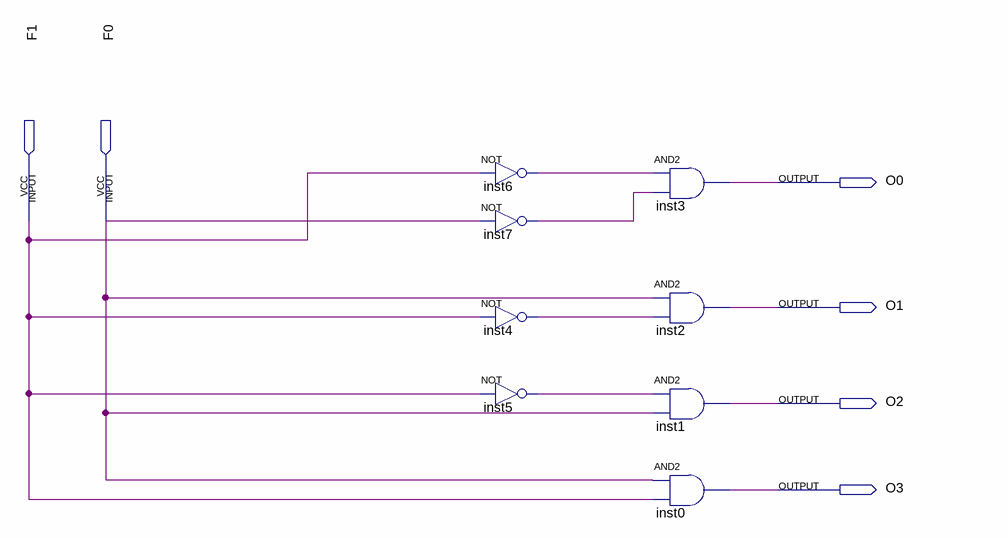
[diagram p0: schematic sheet]
// Quartus schematic DECODER_2x4.bdf as structural Verilog: 8 symbols, 6 pins
module DECODER_2x4 (
  input  F1,
  input  F0,
  output O0,
  output O1,
  output O2,
  output O3
);

  wire inst4_out, inst5_out, inst6_out, inst7_out;

  not inst6 (inst6_out, F1);
  not inst7 (inst7_out, F0);
  not inst4 (inst4_out, F1);
  not inst5 (inst5_out, F1);
  and inst3 (O0, inst6_out, inst7_out);
  and inst2 (O1, F0, inst4_out);
  and inst1 (O2, inst5_out, F0);
  and inst0 (O3, F0, F1);
endmodule
